# EasyEDA Pro project ProPrj_BSPD_2025-08-26.epro, board PCB2
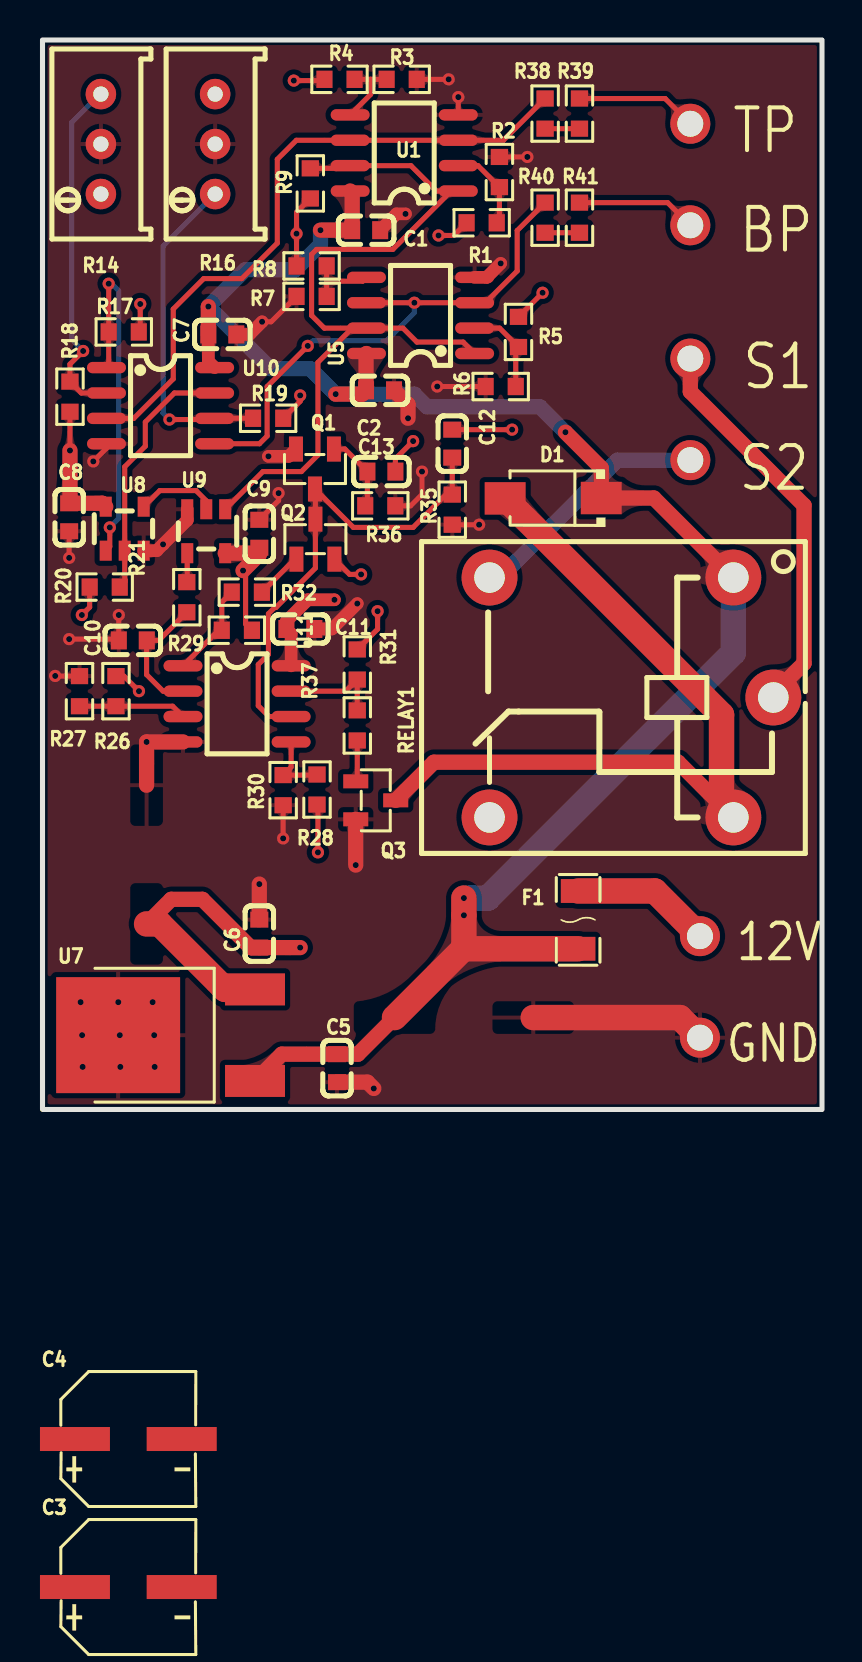
[diagram p4: board, top side]
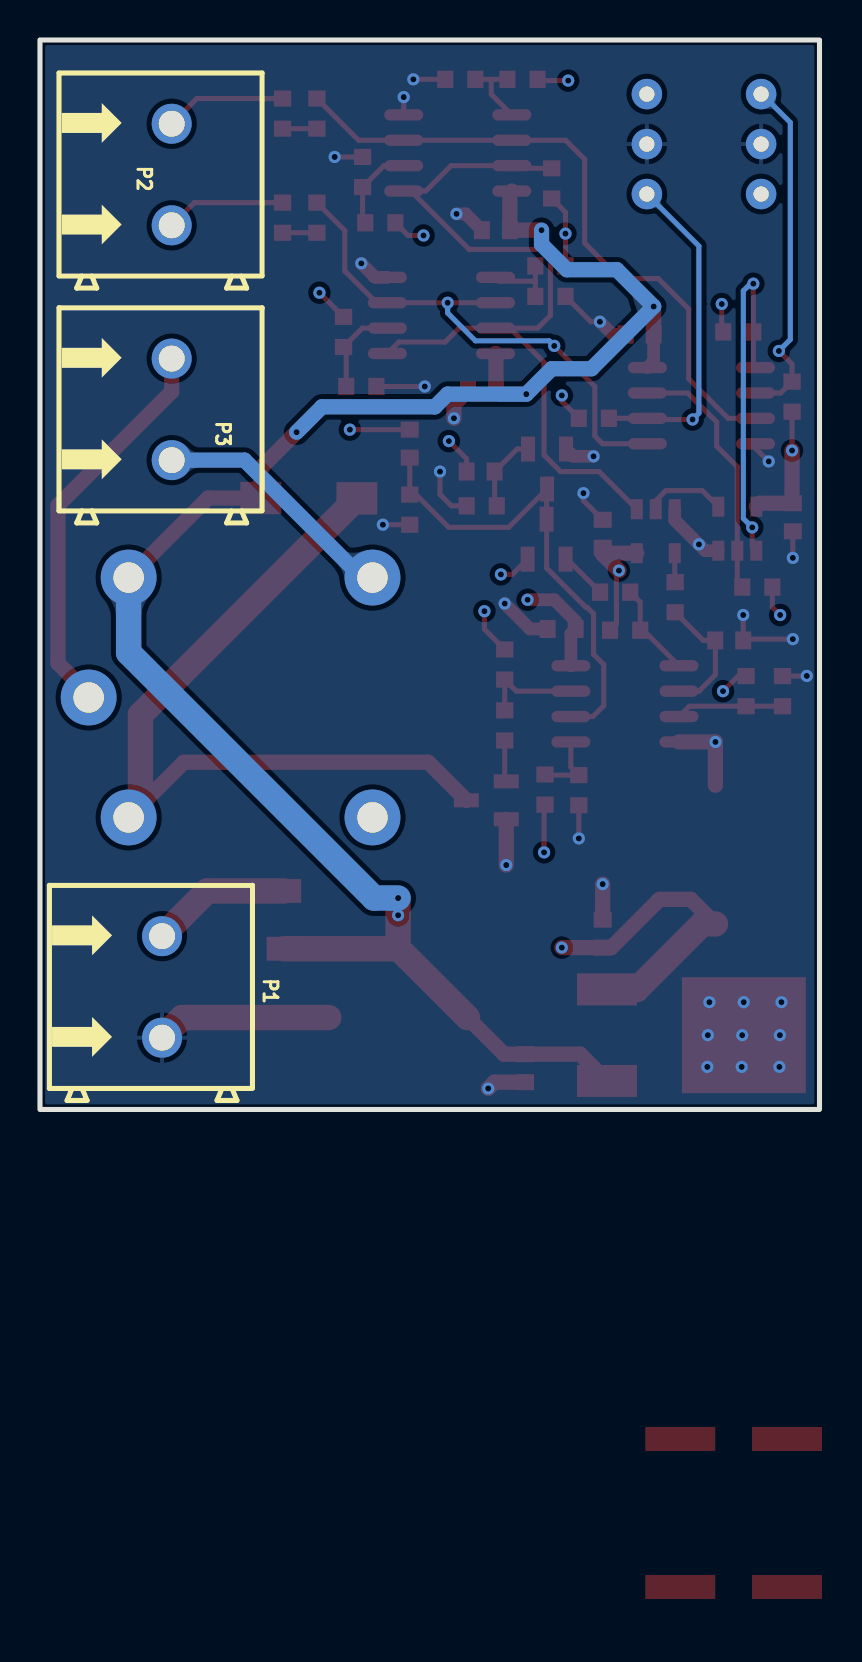
[diagram p5: board, bottom side, seen from below]

Outline 39 x 53.5 mm; copper layers: Top Layer, GND, 5V, Bottom Layer. Coordinates in mm from the lower left corner of the outline.
Outline path: rectangle 0,53.5 39,0
Stack: Top Layer 0.035mm 外层铜厚1oz / Dielectric1 0.2104mm 7628 RC49% 8.6mil / GND 0.0152mm 内层铜厚 / Dielectric2 1.065mm 1.1mm H/HOZ 含铜 / 5V 0.0152mm 内层铜厚 / Dielectric3 0.2104mm 7628 RC49% 8.6mil / Bottom Layer 0.035mm 外层铜厚1oz

## Design rules (mm)
template: JLCPCB Capability(Two Layers Board)
spacing copperThickness1oz (default): track to track 0.102, other pairs 0.152 to 0.3
spacing copperThickness2oz: track to track 0.203, other pairs 0.152 to 0.3
track width copperThickness1oz (default): min 0.127, default 0.254, max 2.54
track width copperThickness2oz: min 0.203, default 0.254, max 2.54
differential pair differentialPair (default): width min 0.127, default 0.254, max 2.54; gap min 0.152, default 0.152
via viaSize (default): diameter min 0.5, default 0.61, max 10; hole min 0.3, default 0.305, max 6.3

## Placement (name value [footprint] x y rotation side)
C1  100nF  [C0603]  16.19 43.99 0 top
C2  100nF  [C0603]  16.89 35.97 0 top
C3  100uF  [CAP-SMD_BD6.3-L6.6-W6.6-LS7.4-FD]  4.29 -23.89 0 top
C4  100uF  [CAP-SMD_BD6.3-L6.6-W6.6-LS7.4-FD]  4.29 -16.49 0 top
C5  100nF  [C0603]  14.73 2.07 90 top
C6  100nF  [C0603]  10.85 8.8 90 top
C7  100nF  [C0603]  9 38.77 0 top
C8  100nF  [C0603]  1.33 29.62 270 top
C9  100nF  [C0603]  10.85 28.8 90 top
C10  10uF  [C0603]  4.52 23.46 0 top
C11  100nF  [C0603]  12.9 24.04 0 top
C12  10uF  [C0603]  20.5 33.31 90 top
C13  100nF  [C0603]  16.95 31.91 0 top
D1  M4  [SMA_L4.3-W2.6-LS5.0-RD]  25.55 30.58 180 top
F1  nSMD005  [F1206]  26.8 9.48 270 top
P1  WJ500V-5.08-2P  [CONN-TH_2P-P5.00_WJ500V-5.08-2P]  32.89 6.13 90 bottom
P2  WJ500V-5.08-2P  [CONN-TH_2P-P5.00_WJ500V-5.08-2P]  32.41 46.77 90 bottom
P3  WJ500V-5.08-2P  [CONN-TH_2P-P5.00_WJ500V-5.08-2P]  32.41 35.02 90 bottom
Q1  BSS138  [SOT-23-3_L2.9-W1.3-P1.90-LS2.4-BR]  13.63 32.04 90 top
Q2  BSS84  [SOT-23-3_L2.9-W1.3-P1.90-LS2.4-BR-1]  13.65 28.53 270 top
Q3  BSS138  [SOT-23-3_L2.9-W1.3-P1.90-LS2.4-BR]  16.67 15.46 180 top
R1  100kΩ  [R0603]  21.97 44.36 180 top
R2  1kΩ  [R0603]  22.86 46.89 270 top
R3  100kΩ  [R0603]  17.97 51.53 180 top
R4  1kΩ  [R0603]  14.86 51.53 180 top
R5  100kΩ  [R0603]  23.81 38.9 90 top
R6  1kΩ  [R0603]  22.92 36.16 0 top
R7  100kΩ  [R0603]  13.46 40.67 0 top
R8  1kΩ  [R0603]  13.46 42.2 180 top
R9  10kΩ  [R0603]  13.4 46.32 270 top
R14  10kΩ  [RES-ADJ-TH_3P-L10.0-W10.0-P2.50-L]  2.92 48.29 90 top
R16  10kΩ  [RES-ADJ-TH_3P-L10.0-W10.0-P2.50-L]  8.64 48.29 90 top
R17  10kΩ  [R0603]  4.06 38.9 0 top
R18  10kΩ  [R0603]  1.37 35.66 270 top
R19  10kΩ  [R0603]  11.29 34.58 0 top
R20  10kΩ  [R0603]  3.11 26.13 180 top
R21  40.2kΩ  [R0603]  7.22 25.62 270 top
R26  39kΩ  [R0603]  3.67 20.92 90 top
R27  100kΩ  [R0603]  1.85 20.92 270 top
R28  39kΩ  [R0603]  13.73 16 270 top
R29  10kΩ  [R0603]  9.72 23.97 0 top
R30  10kΩ  [R0603]  12.04 15.97 90 top
R31  10kΩ  [R0603]  15.75 22.26 90 top
R32  100Ω  [R0603]  10.22 25.88 180 top
R35  1MΩ  [R0603]  20.5 30.01 90 top
R36  750kΩ  [R0603]  16.9 30.2 180 top
R37  100Ω  [R0603]  15.75 19.21 270 top
R38  10kΩ  [R0603]  25.15 49.82 90 top
R39  100kΩ  [R0603]  26.86 49.82 90 top
R40  10kΩ  [R0603]  25.15 44.61 90 top
R41  100kΩ  [R0603]  26.86 44.61 270 top
RELAY1  SRD-12VDC-SL-C  [RELAY-TH_SRD-XXVDC-XL-C]  29.46 20.61 180 top
U1  LM393DR  [SOIC-8_L5.0-W4.0-P1.27-LS6.0-BL]  18.1 47.85 90 top
U5  LM393DR  [SOIC-8_L5.0-W4.0-P1.27-LS6.0-BL]  18.91 39.72 90 top
U7  78M05  [TO-252-2_L6.6-W6.1-P4.57-LS9.9-BR-CW]  7.21 3.72 0 top
U8  SN74LVC1G00DBVR(UMW)  [SOT-23-5_L2.9-W1.6-P0.95-LS2.8-BL]  4.11 29.05 0 top
U9  SN74LVC1G00DBVR(UMW)  [SOT-23-5_L2.9-W1.6-P0.95-LS2.8-BL]  8.19 28.93 180 top
U10  LM393DR  [SOIC-8_L5.0-W4.0-P1.27-LS6.0-BL]  5.91 35.21 270 top
U11  LM393DR  [SOIC-8_L5.0-W4.0-P1.27-LS6.0-BL]  9.73 20.29 270 top

## Footprints (pads in the part's own frame, mm; a bottom-side part is the same pattern mirrored in y, then rotated)
C0603
  rect 0.8x0.9 smd: 1(-0.7,0) 2(0.7,0)
CAP-SMD_BD6.3-L6.6-W6.6-LS7.4-FD
  rect 3.5x1.2 smd: 1(-2.67,0) 2(2.67,0)
CONN-TH_2P-P5.00_WJ500V-5.08-2P
  round 2 hole 1.3: 1(-2.54,0) 2(2.54,0)
F1206
  rect 1.19x1.728 smd: 1(-1.445,0) 2(1.445,0)
R0603
  rect 0.806x0.864 smd: 1(-0.753,0) 2(0.753,0)
RELAY-TH_SRD-XXVDC-XL-C
  round 2.794 hole 1.524: 1(-5.1,-6) 2(7.1,-6) 3(7.1,6) 4(-5.1,6) 5(-7.1,0)
RES-ADJ-TH_3P-L10.0-W10.0-P2.50-L
  round 1.524 hole 0.762: 1(-2.5,0) 2(0,0) 3(2.5,0)
SMA_L4.3-W2.6-LS5.0-RD
  rect 2.046x1.62 smd: 1(-2.404,-0.009) 2(2.404,0.009)
SOIC-8_L5.0-W4.0-P1.27-LS6.0-BL
  oval 0.569x1.95 smd: 1(-1.905,-2.705) 2(-0.635,-2.705) 3(0.635,-2.705) 4(1.905,-2.705) 5(1.905,2.705) 6(0.635,2.705) 7(-0.635,2.705) 8(-1.905,2.705)
SOT-23-3_L2.9-W1.3-P1.90-LS2.4-BR
  rect 1.25x0.7 smd: 1(1,-0.95) 2(1,0.95) 3(-1,0)
SOT-23-3_L2.9-W1.3-P1.90-LS2.4-BR-1
  rect 1.25x0.7 smd: 1(1,-0.95) 2(1,0.95) 3(-1,0)
SOT-23-5_L2.9-W1.6-P0.95-LS2.8-BL
  rect 0.6x1 smd: 1(-0.95,-1.1) 2(0,-1.1) 3(0.95,-1.1) 4(0.95,1.1) 5(-0.95,1.1)
TO-252-2_L6.6-W6.1-P4.57-LS9.9-BR-CW
  rect 3x1.6 smd: 1(3.424,-2.29) 3(3.424,2.29)
  rect 6.2x5.8 smd: 2(-3.424,0)

## Nets
As in the schematic.

Pads without a net: R14 1; R16 3; RELAY1 3

## Via types
v1: diameter 0.61, hole 0.305, Top Layer to Bottom Layer, 62 vias

## Routing (per net, layer and track width the routed paths; a pad name or vN(x,y) marks a point on that pad's centre or on a via; arc(x,y) is an arc through that point)
12V: length 94.4
  Top Layer w0.635: C7.1 8.3,37.42 U10.8
  Top Layer w0.762: C7.1 v1(8.3,40.17) ; U7.1 11.97,2.77 C5.2 15.78,2.77 17.61,4.6 ; 16.21,37.82 16.19,37.79 C2.1 16,35.78 v1(14.67,35.78) ; v1(26.16,33.88) 27.95,32.09 D1.1 30.58,30.59 RELAY1.1 ; U1.8 15.49,45.84 C1.1 v1(13.91,43.99)
  Top Layer w1.27: F1.2 21.05,8.04 ; 21.05,8.04 21.08,8.07 v1(21.08,9.71) v1(21.08,10.57) ; 21.05,8.04 17.61,4.6
  Bottom Layer w0.762: v1(13.91,43.99) 13.91,43.28 12.64,42.01 10.14,42.01 v1(8.3,40.17) 11.41,37.05 13.4,37.05 v1(14.67,35.78) 18.61,35.78 19.24,35.15 24.89,35.15 v1(26.16,33.88)
  Bottom Layer w1.27: RELAY1.1 34.56,22.85 22.29,10.57 v1(21.08,10.57)
+5V: length 59.9
  Top Layer w0.254: v1(19.81,43.72) 20.58,43.72 R1.2 ; C13.2 17.65,32.55 v1(18.54,33.43) ; R26.2 4.07,21.68 v1(4.83,20.92) ; Q2.2 15.36,26.77 v1(15.94,26.77) ; v1(1.97,24.73) 2.36,25.12 R20.2 ; R29.2 10.16,24.29 10.16,26.83 v1(10.03,26.96) ; R4.2 14.04,51.47 v1(12.57,51.47) ; 25.02,40.86 v1(25.02,40.86) R5.2 ; R28.2 13.78,15.2 v1(13.78,12.86) ; v1(4.89,40.29) 4.89,38.97 R17.2 ; R31.2 16.76,24.03 v1(16.76,24.93) ; R18.2 v1(1.37,32.96) ; R9.2 12.71,44.88 v1(12.71,43.81) R8.2 ; C12.2 v1(23.5,34.01) ; v1(12.89,35.72) 12.89,35.43 R19.2
  Top Layer w0.635: v1(14.6,25.5) 13.27,25.5 12.2,24.43 C11.1 12.44,23.8 U11.8
  Top Layer w0.762: v1(1.37,32.96) 1.37,30.36 C8.1 2.99,30.32 U8.5 ; 5.21,9.28 6.44,10.51 8,10.51 10.42,8.1 C6.1 v1(12.89,8.1) ; U9.5 10.57,27.83 C9.1 10.85,27.77 v1(10.03,26.96)
  Top Layer w1.27: 5.21,9.28 5.87,9.28 9.14,6.01 U7.3
GND: length 56.3
  Top Layer w0.254: R35.1 v1(21.84,29.25) ; R2.1 v1(24.26,47.65) ; R3.1 v1(20.32,51.53) ; C8.2 v1(1.33,27.59) ; R36.1 18.41,30.2 18.99,30.77 v1(18.99,31.91) ; R30.1 v1(12.04,13.56) ; v1(0.63,21.69) 0.64,21.68 R27.1 ; U10.4 3.2,33.08 v1(2.54,32.42) ; C9.2 11.81,30.46 v1(11.81,30.83) ; U1.4 v1(20.8,50.64) ; v1(3.82,24.73) C10.1 3.75,23.53 v1(1.33,23.53) ; R6.1 v1(19.75,36.16) ; v1(10.99,39.4) 11.44,39.4 R7.1
  Top Layer w0.635: v1(15.75,25.31) 14.48,24.04 C11.2 ; v1(11.3,32.67) 12.32,32.67 Q1.2 ; v1(10.99,39.4) 10.35,38.77 C7.2 ; U9.3 7.24,29.48 v1(6.03,28.27) 5.72,27.95 U8.3 ; v1(18.16,44.8) 17.71,44.8 C1.2 ; v1(22.92,42.32) 22.22,41.63 U5.4
  Top Layer w0.762: v1(18.29,34.58) 18.29,35.27 C2.2 ; U11.4 v1(5.21,18.38) 5.21,16.22 ; C5.1 16.26,1.37 v1(16.57,1.05) ; Q3.2 v1(15.67,12.23) ; C6.2 v1(10.85,11.27)
  Top Layer w1.27: P1.1 31.89,4.6 24.55,4.6
  vias: v1(1.91,5.37) v1(1.98,3.72) v1(2.01,2.13) v1(3.79,5.37) v1(3.87,3.72) v1(3.89,2.13) v1(5.51,5.37) v1(5.59,3.72) v1(5.61,2.13)
BREAK: length 26.9
  Top Layer w0.254: 16.21,40.36 v1(18.6,40.36) U5.3 22.16,40.36 23.75,41.94 23.75,43.97 R40.2 ; v1(13.27,38.2) 11.24,36.16 11.24,33.69 10.85,33.3 U10.5
  Bottom Layer w0.254: v1(18.6,40.36) 18.6,39.85 17.21,38.45 13.53,38.45 v1(13.27,38.2)
SC1: length 19.9
  Top Layer w0.762: P3.2 32.41,35.91 38.1,30.22 38.1,22.32 36.56,20.79 RELAY1.5
SC2: length 12.5
  Bottom Layer w0.762: P3.1 28.77,32.48 22.89,26.61 RELAY1.2
TPS: length 33.1
  Top Layer w0.254: R38.2 23.06,48.48 U1.3 U1.6 12.7,48.48 11.75,47.53 11.75,43.34 9.97,41.56 8.06,41.56 6.54,40.04 6.54,36.55 4.57,34.57 U10.3
$1N548: length 4.3
  Top Layer w0.254: R1.1 22.86,44.49 R2.2 21.79,47.21 U1.2
$1N720: length 3.8
  Top Layer w0.254: 16.42,51.53 16.42,50.78 U1.5 ; 16.42,51.53 R4.1 ; 16.42,51.53 R3.2
$1N1527: length 4.6
  Top Layer w0.254: R6.2 23.68,38.01 R5.1 22.87,39.09 U5.2
$1N1535: length 3.6
  Top Layer w0.254: R7.2 14.22,41.43 ; 14.22,41.43 16.02,41.43 16.21,41.63 ; 14.22,41.43 R8.1
$1N3454: length 41.1
  Top Layer w0.254: 20.45,45.94 U1.1 ; 20.45,45.94 19.7,45.94 18.43,47.21 U1.7 15.26,47.08 R9.1 ; 20.45,45.94 17.53,43.02 13.71,43.02 13.46,42.78 13.46,39.72 14.1,39.09 15.49,39.09 ; 15.49,39.09 13.78,37.37 13.78,32.74 12.95,31.91 11.03,31.91 U9.1 ; 15.49,39.09 18.03,39.09 18.73,38.39 21.05,38.39 U5.1
$1N3800: length 17.6
  Top Layer w0.254: v1(2.03,37.94) 1.37,37.28 R18.1 1.94,35.84 U10.2
  Bottom Layer w0.254: R14.3 2.88,50.79 1.46,49.37 1.46,38.51 v1(2.03,37.94)
$1N4317: length 18.2
  Top Layer w0.254: U8.1 3.37,28.16 v1(3.37,29.12) ; U10.1 3.31,37.22 R17.1 v1(3.31,41.31)
  Bottom Layer w0.254: v1(3.31,41.31) 3.45,41.31 3.81,40.95 3.81,29.56 v1(3.37,29.12)
$1N4325: length 12.9
  Top Layer w0.254: U10.7 6.6,35.84 5.14,34.39 5.14,33.18 4.11,32.15 U8.2 4.11,26.38 R20.1
$1N4493: length 16.7
  Top Layer w0.254: 8.5,34.57 8.55,34.51 v1(6.35,34.51) ; R19.1 8.62,34.58 U10.6
  Bottom Layer w0.254: v1(6.35,34.51) 6.03,34.83 6.03,43.19 R16.1
$1N4504: length 4.1
  Top Layer w0.254: U8.4 5.87,30.96 7.68,30.96 8.19,30.45 U9.2
$1N4584: length 1.5
  Top Layer w0.254: R21.1 7.24,26.4 U9.4
$1N5048: length 3.5
  Top Layer w0.254: U11.5 12.44,17.12 R30.2 13.7,16.73 13.73,16.76
$1N5249: length 5.4
  Top Layer w0.254: R27.2 R26.1 6.51,20.17 U11.3
$1N5269: length 6.5
  Top Layer w0.254: R21.2 5.81,23.46 C10.2 5.21,23.46 5.21,21.75 6.03,20.92 U11.2
$1N5671: length 4.8
  Top Layer w0.254: R32.2 8.97,25.38 8.97,23.97 8.81,23.97 U11.1
$1N6198: length 24.1
  Top Layer w0.254: 20.5,32.61 R35.2 20.18,30.76 18.54,29.12 15.55,29.12 13.65,31.02 ; 13.65,31.02 Q1.3 ; 13.65,31.02 Q2.3 13.65,27.08 11.68,25.12 11.62,25.12 11.3,24.8 11.3,22.77 10.79,22.26 10.79,20.2 11.34,19.65 U11.6
$1N6463: length 3.9
  Top Layer w0.254: Q1.1 15.13,33.04 C13.1 16.25,30.3 R36.2
$1N6650: length 2.1
  Top Layer w0.254: Q3.1 15.75,16.49 R37.2
$1N6763: length 38.7
  Top Layer w0.762: Q3.3 19.58,17.37 31.8,17.37 33.97,15.2
  Top Layer w1.27: RELAY1.4 33.97,15.2 33.97,19.74 D1.2
$1N6823: length 5.1
  Top Layer w0.254: U11.7 15.17,20.92 R31.1 R37.1
$1N6833: length 2.4
  Top Layer w0.254: R32.1 12.63,27.53 Q2.1
$1N10439: length 7
  Top Layer w1.27: P1.2 30.63,10.93 F1.1
$1N10686: length 7.7
  Top Layer w0.254: R41.1 31.28,45.36 P2.1 ; 26.86,43.86 R40.1
$1N10689: length 7.8
  Top Layer w0.254: R39.2 31.15,50.57 P2.2 ; 26.86,49.06 R38.1

## Copper pours and planes (outline as drawn; the poured copper is in the pictures)
+5V on 5V: 0.26,53.24 38.74,53.24 38.74,0.26 0.26,0.26
GND on Top Layer: 0,53.5 39,53.5 39,0 0,0
GND on Bottom Layer: 0,53.5 39,53.5 39,0 0,0
GND on GND: 0.26,53.24 38.74,53.24 38.74,0.26 0.26,0.26

Small or netless copper shapes (teardrops, artwork), in the pictures only: 193 on Top Layer, 13 on Bottom Layer, 12 on GND

## Text on the board
Top Silkscreen Layer: GND | 12V | TP | S2 | BP | S1
